# Altium schematic sheet Power 5V Boost Converter.SchDoc: 5V Buck/Boost Converter
size 292 x 193 mm; SheetNumber: 5; SheetTotal: 40
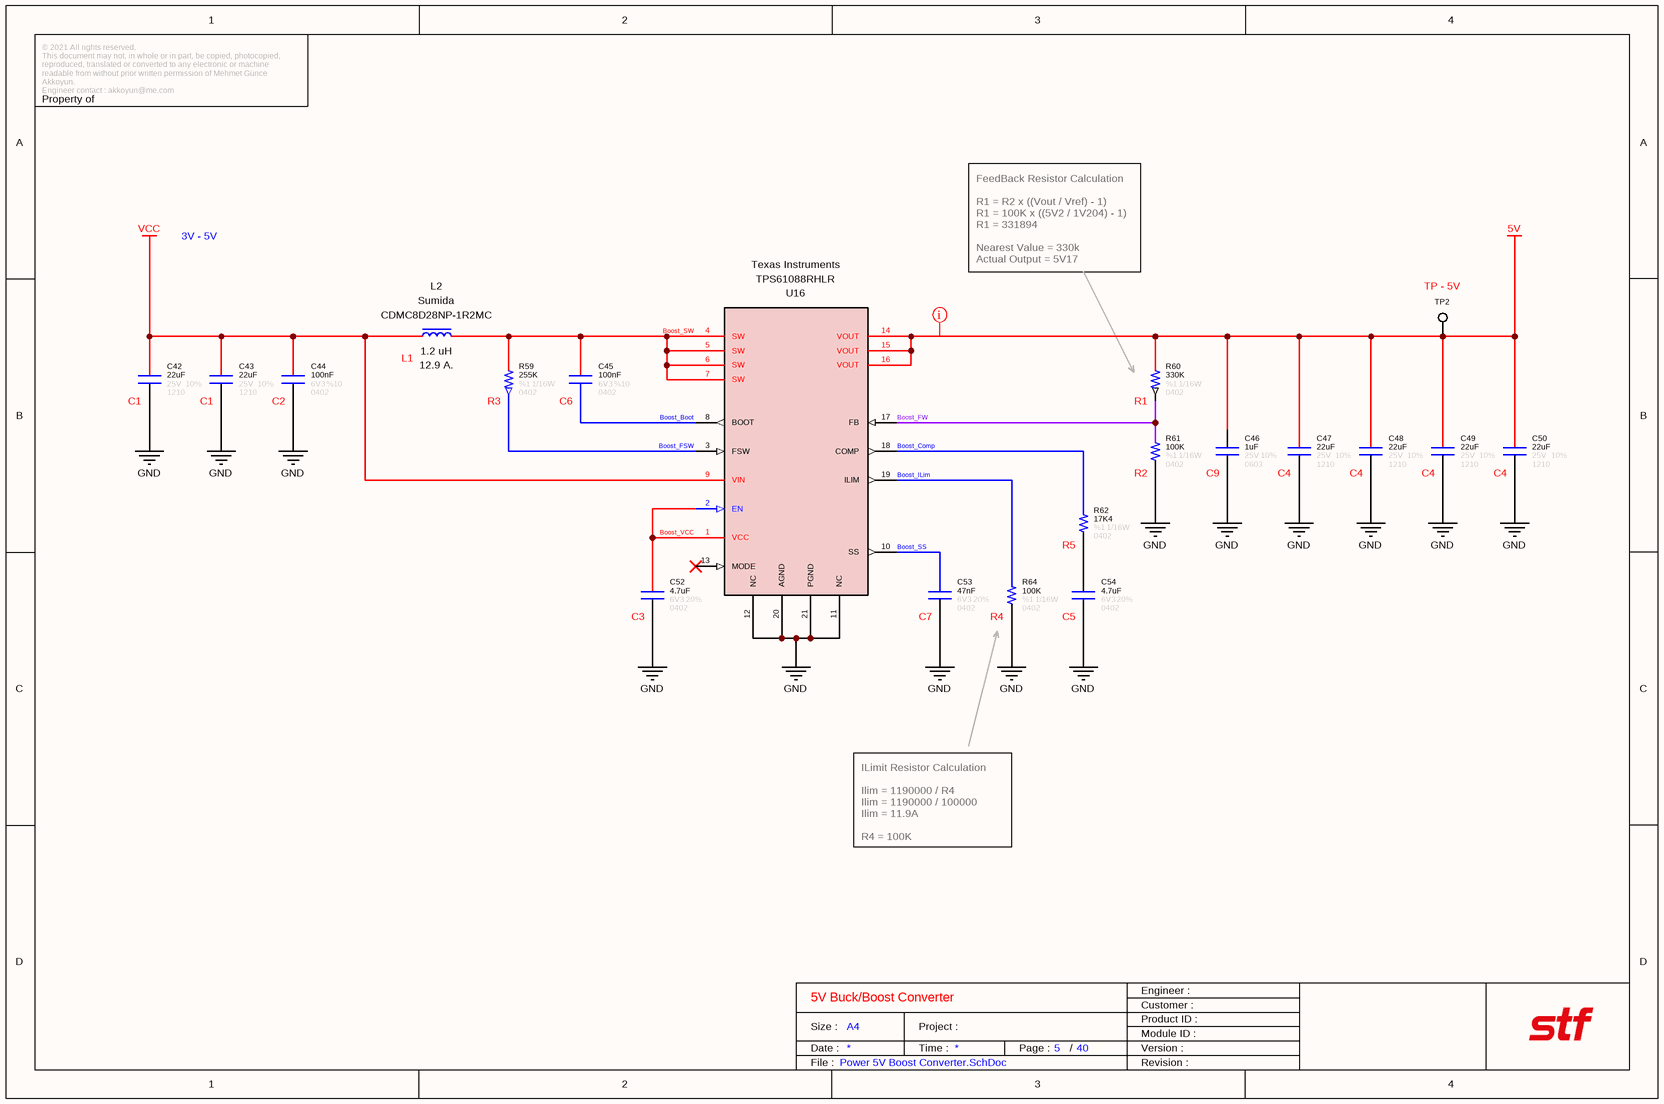
[diagram p0: Power 5V Boost Converter.SchDoc]

## Parts
C42  value 22uF  Tolerance: 10%  Case: 1210  Voltage: 25V  [CAPACITOR_0603]  (hidden comment: Capacitor - 22uF [1210] (Ceramic))
C43  value 22uF  Tolerance: 10%  Case: 1210  Voltage: 25V  [CAPACITOR_0603]  (hidden comment: Capacitor - 22uF [1210] (Ceramic))
C44  value 100nF  Tolerance: %10  Voltage: 6V3  Case: 0402  [CAPACITOR_0402]  (hidden comment: Capacitor - 100nF [0402] (Ceramic))
C45  value 100nF  Tolerance: %10  Voltage: 6V3  Case: 0402  [CAPACITOR_0402]  (hidden comment: Capacitor - 100nF [0402] (Ceramic))
C46  value 1uF  Tolerance: 10%  Case: 0603  Voltage: 25V  [CAPACITOR_0603]  (hidden comment: Capacitor - 1uF [0603] (Ceramic))
C47  value 22uF  Tolerance: 10%  Case: 1210  Voltage: 25V  [CAPACITOR_0603]  (hidden comment: Capacitor - 22uF [1210] (Ceramic))
C48  value 22uF  Tolerance: 10%  Case: 1210  Voltage: 25V  [CAPACITOR_0603]  (hidden comment: Capacitor - 22uF [1210] (Ceramic))
C49  value 22uF  Tolerance: 10%  Case: 1210  Voltage: 25V  [CAPACITOR_0603]  (hidden comment: Capacitor - 22uF [1210] (Ceramic))
C50  value 22uF  Tolerance: 10%  Case: 1210  Voltage: 25V  [CAPACITOR_0603]  (hidden comment: Capacitor - 22uF [1210] (Ceramic))
C52  value 4.7uF  Tolerance: 20%  Case: 0402  Voltage: 6V3  [CAPACITOR_0402]  (hidden comment: Capacitor - 4.7uF [0402] (Ceramic))
C53  value 47nF  Tolerance: 20%  Case: 0402  Voltage: 6V3  [CAPACITOR_0402]  (hidden comment: Capacitor - 47nF [0402] (Ceramic))
C54  value 4.7uF  Tolerance: 20%  Case: 0402  Voltage: 6V3  [CAPACITOR_0402]  (hidden comment: Capacitor - 4.7uF [0402] (Ceramic))
L2  value 1.2 uH  Manufacturer Name: Sumida  Maximum DC Current: 12.9 A.  [SRP4020TA]  (hidden comment: CDMC8D28NP-1R2MC)
R59  value 255K  Power: 1/16W  Case: 0402  Tolerance: %1  [RESISTOR_0402]  (hidden comment: 255K - 0402 - %1 - 1/16W)
R60  value 330K  Tolerance: %1  Case: 0402  Power: 1/16W  [RESISTOR_0402]  (hidden comment: 330K - 0402 - %1 - 1/16W)
R61  value 100K  Tolerance: %1  Case: 0402  Power: 1/16W  [RESISTOR_0402]  (hidden comment: 100K - 0402 - %1 - 1/16W)
R62  value 17K4  Tolerance: %1  Case: 0402  Power: 1/16W  [RESISTOR_0402]  (hidden comment: 17K4 - 0402 - %1 - 1/16W)
R64  value 100K  Tolerance: %1  Case: 0402  Power: 1/16W  [RESISTOR_0402]  (hidden comment: 100K - 0402 - %1 - 1/16W)
TP2  TP - 5V  [TP]  (no BOM)
U16  Manufacturer Name: Texas Instruments  [VQFN-20]  (hidden comment: TPS61088RHLR)

## Nets
5V: C46.2 C47.2 C48.2 C49.2 C50.2 R60.2 TP2.1 U16.14(VOUT) U16.15(VOUT) U16.16(VOUT)
GND: C42.1 C43.1 C44.1 C46.1 C47.1 C48.1 C49.1 C50.1 C52.1 C53.1 C54.1 R61.1 R64.1 U16.11(NC) U16.12(NC) U16.20(AGND) U16.21(PGND)
VCC: C42.2 C43.2 C44.2 L2.1 U16.9(VIN)
Boost_Boot: C45.1 U16.8(BOOT)
Boost_Comp: R62.2 U16.18(COMP)
Boost_FSW: R59.1 U16.3(FSW)
Boost_FW: R60.1 R61.2 U16.17(FB)
Boost_ILim: R64.2 U16.19(ILIM)
Boost_SS: C53.2 U16.10(SS)
Boost_SW: C45.2 L2.2 R59.2 U16.4(SW) U16.5(SW) U16.6(SW) U16.7(SW)
Boost_VCC: C52.2 U16.1(VCC) U16.2(EN)
NetC54_2: C54.2 R62.1

Not connected (* = marked no-connect by the designer): U16 13(MODE)*

## Layout directives
rule Supply Nets [Voltage = 5.170]: 5V

## Notes on the sheet
- 3V - 5V
- FeedBack Resistor Calculation
  R1 = R2 x ((Vout / Vref) - 1)
  R1 = 100K x ((5V2 / 1V204) - 1)
  R1 = 331894
  Nearest Value = 330k
  Actual Output = 5V17
- (near C42) C1
- (near C43) C1
- (near C44) C2
- (near L2) L1
- (near R59) R3
- (near C45) C6
- (near R60) R1
- (near R61) R2
- (near C46) C9
- (near C47) C4
- (near C48) C4
- (near C49) C4
- (near C50) C4
- (near R62) R5
- (near C52) C3
- (near C53) C7
- (near R64) R4
- (near C54) C5
- ILimit Resistor Calculation
  Ilim = 1190000 / R4
  Ilim = 1190000 / 100000
  Ilim = 11.9A
  R4 = 100K
- © 2021 All rights reserved.
  This document may not, in whole or in part, be copied, photocopied, reproduced, translated or converted to any electronic or machine readable from without prior written permission of Mehmet Günce Akkoyun.
  Engineer contact : akkoyun@me.com
- Property of
- Engineer :
- Date :
- Size :
- A4
- Time :
- Project :
- Page :
- /
- Customer :
- Product ID :
- Module ID :
- Version :
- File :
- Revision :

## Library data of the parts
C42 C43 C47-C50 = Capacitor - 22uF [1210-6V3]: Multilayer Ceramic Capacitors MLCC - SMD/SMT 22UF 25V 10% 1210; Manufacturer Part Number: GRM32ER71E226KE15L; Manufacturer Name: Murata
C44 C45 = Capacitor - 100nF [0402-6V3]: Capacitor - 100nF [0402-6V3] (Ceramic); Manufacturer Name: AVX; Manufacturer Part Number: 04026D104KAT4A; ComponentLink1Description: Mouser; ComponentLink1URL: https://www.mouser.com.tr/ProductDetail/AVX/04026D104KAT4A?qs=sGAEpiMZZMs0AnBnWHyRQPg4iYkCw7IMED%2F4kpqgf7w%3D; ComponentLink2Description: DataSheet; ComponentLink2URL: https://www.mouser.com.tr/datasheet/2/40/cx5r-776519.pdf
C46 = Capacitor - 1uF [0603-25V]: Multilayer Ceramic Capacitors - SMD - 25V 1uF X7R 0603 10%; Manufacturer Part Number: GCJ188R71E105KA01D; Manufacturer Name: Murata
C52 C54 = Capacitor - 4.7uF [0402-6V3]: Multilayer Ceramic Capacitors - SMD - 6V3 4.7uF X5R 0402 20%; Manufacturer Part Number: C0402C475M9PACTU; Manufacturer Name: KEMET
C53 = Capacitor - 47nF [0402-6V3]: Multilayer Ceramic Capacitors - SMD - 6.3V 47nF X7R 0402 10%; Manufacturer Name: AVX; Manufacturer Part Number: 04026C472MAT2A
L2 = Inductor - CDMC8D28NP-1R2MC: Power Inductors - SMD SMD Power Inductor 1.2UH 12.9A; Maximum DC Resistance: 7 mOhms; Tolerance: 20%; Core Material: Metal Composite; Maximum Operating Temperature: +125 C; ROHS: Yes; Minimum Operating Temperature: -40 C; Height: 3mm; Product Type: Power Inductor; Case: SMD; Manufacturer Part Number: CDMC8D28NP-1R2MC
R59 = Resistor - 255K [0402]: Thick Film Resistors - SMD 1/16 W 255 KOhm 1%; Manufacturer Name: Vishay; Manufacturer Part Number: CRCW0402255KFKED
R60 = Resistor - 330K [0402]: Thick Film Resistors - SMD 1/16 W 330 KOhm 1%; Manufacturer Name: Vishay; Manufacturer Part Number: CRCW0402330KFKED; ComponentLink1Description: DataSheet; ComponentLink1URL: https://www.mouser.com.tr/datasheet/2/427/dcrcwe3-1762152.pdf; ComponentLink2Description: Mouser; ComponentLink2URL: https://www.mouser.com.tr/ProductDetail/Vishay-Dale/CRCW040210K0FKED?qs=sGAEpiMZZMu61qfTUdNhG2DpbjADlD3GcalbOv9utCY%3D
R61 R64 = Resistor - 100K [0402]: Thick Film Resistors - SMD 1/16 W 100 KOhm 1%; Manufacturer Name: Vishay; Manufacturer Part Number: CRCW0402100KFKED; ComponentLink1Description: DataSheet; ComponentLink1URL: https://www.mouser.com.tr/datasheet/2/427/dcrcwe3-1762152.pdf; ComponentLink2Description: Mouser; ComponentLink2URL: https://www.mouser.com.tr/ProductDetail/Vishay-Dale/CRCW040210K0FKED?qs=sGAEpiMZZMu61qfTUdNhG2DpbjADlD3GcalbOv9utCY%3D
R62 = Resistor - 17K4 [0402]: Thick Film Resistors - SMD 1/16 W 17.4 KOhm 1%; Manufacturer Name: Vishay; Manufacturer Part Number: CRCW040217K4FKED; ComponentLink1Description: DataSheet; ComponentLink1URL: https://www.mouser.com.tr/datasheet/2/427/dcrcwe3-1762152.pdf; ComponentLink2Description: Mouser; ComponentLink2URL: https://www.mouser.com.tr/ProductDetail/Vishay-Dale/CRCW040210K0FKED?qs=sGAEpiMZZMu61qfTUdNhG2DpbjADlD3GcalbOv9utCY%3D
TP2 = PCB - Test Point: Test Point
U16 = IC - TPS61088: Switching Voltage Regulators 10-A Fully-Integrated Synchronous Boost Converter 20-VQFN -40 to 85; Case: VQFN-20; Manufacturer Part Number: TPS61088RHLR